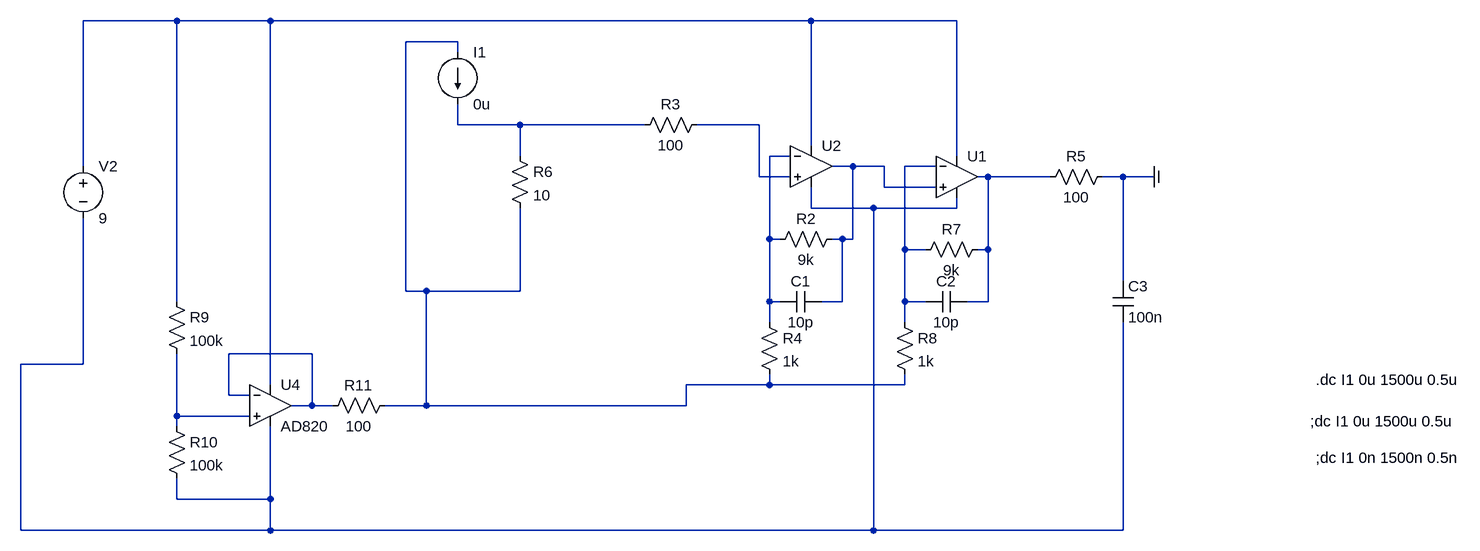
[diagram p0: schematic ucurrent.asc]
ucurrent.asc, the LTspice schematic file:
Version 4
SHEET 1 2176 968
WIRE -480 16 -624 16
WIRE -336 16 -480 16
WIRE 496 16 -336 16
WIRE 720 16 496 16
WIRE -48 48 -128 48
WIRE -48 64 -48 48
WIRE -48 176 -48 144
WIRE 48 176 -48 176
WIRE 240 176 48 176
WIRE 416 176 320 176
WIRE 496 208 496 16
WIRE 48 224 48 176
WIRE 464 224 432 224
WIRE 720 224 720 16
WIRE -624 240 -624 16
WIRE 560 240 528 240
WIRE 608 240 560 240
WIRE 688 240 640 240
WIRE 416 256 416 176
WIRE 464 256 416 256
WIRE 768 256 752 256
WIRE 864 256 768 256
WIRE 976 256 944 256
WIRE 1024 256 976 256
WIRE 608 272 608 240
WIRE 688 272 608 272
WIRE 496 304 496 272
WIRE 592 304 496 304
WIRE 720 304 720 288
WIRE 720 304 592 304
WIRE 432 352 432 224
WIRE 448 352 432 352
WIRE 544 352 528 352
WIRE 560 352 560 240
WIRE 560 352 544 352
WIRE 640 368 640 240
WIRE 672 368 640 368
WIRE 768 368 768 256
WIRE 768 368 752 368
WIRE 976 416 976 256
WIRE -128 432 -128 48
WIRE -96 432 -128 432
WIRE 48 432 48 304
WIRE 48 432 -96 432
WIRE -480 448 -480 16
WIRE 432 448 432 352
WIRE 448 448 432 448
WIRE 544 448 544 352
WIRE 544 448 512 448
WIRE 640 448 640 368
WIRE 672 448 640 448
WIRE 768 448 768 368
WIRE 768 448 736 448
WIRE 432 480 432 448
WIRE 640 480 640 448
WIRE -272 528 -400 528
WIRE -624 544 -624 320
WIRE -624 544 -720 544
WIRE -336 576 -336 16
WIRE 432 576 432 560
WIRE 432 576 304 576
WIRE 640 576 640 560
WIRE 640 576 432 576
WIRE -400 592 -400 528
WIRE -368 592 -400 592
WIRE -272 608 -272 528
WIRE -272 608 -304 608
WIRE -240 608 -272 608
WIRE -96 608 -96 432
WIRE -96 608 -160 608
WIRE 304 608 304 576
WIRE 304 608 -96 608
WIRE -480 624 -480 528
WIRE -368 624 -480 624
WIRE -480 640 -480 624
WIRE -480 752 -480 720
WIRE -336 752 -336 640
WIRE -336 752 -480 752
WIRE -720 800 -720 544
WIRE -336 800 -336 752
WIRE -336 800 -720 800
WIRE 592 800 592 304
WIRE 592 800 -336 800
WIRE 976 800 976 480
WIRE 976 800 592 800
FLAG 1024 256 COM
IOPIN 1024 256 Out
SYMBOL res 432 368 R270
WINDOW 0 32 56 VTop 2
WINDOW 3 0 56 VBottom 2
SYMATTR InstName R2
SYMATTR Value 9k
SYMBOL res 416 464 R0
SYMATTR InstName R4
SYMATTR Value 1k
SYMBOL res 848 272 R270
WINDOW 0 32 56 VTop 2
WINDOW 3 0 56 VBottom 2
SYMATTR InstName R5
SYMATTR Value 100
SYMBOL res 32 208 R0
SYMATTR InstName R6
SYMATTR Value 10
SYMBOL cap 512 432 R90
WINDOW 0 0 32 VBottom 2
WINDOW 3 32 32 VTop 2
SYMATTR InstName C1
SYMATTR Value 10p
SYMBOL res 224 192 R270
WINDOW 0 32 56 VTop 2
WINDOW 3 0 56 VBottom 2
SYMATTR InstName R3
SYMATTR Value 100
SYMBOL Opamps\\UniversalOpamp2 496 240 R0
SYMATTR InstName U2
SYMBOL current -48 64 R0
WINDOW 123 0 0 Left 0
WINDOW 39 0 0 Left 0
SYMATTR InstName I1
SYMATTR Value 0u
SYMBOL Opamps\\UniversalOpamp2 720 256 R0
SYMATTR InstName U1
SYMBOL res 656 384 R270
WINDOW 0 32 56 VTop 2
WINDOW 3 0 56 VBottom 2
SYMATTR InstName R7
SYMATTR Value 9k
SYMBOL cap 736 432 R90
WINDOW 0 0 32 VBottom 2
WINDOW 3 32 32 VTop 2
SYMATTR InstName C2
SYMATTR Value 10p
SYMBOL res 624 464 R0
SYMATTR InstName R8
SYMATTR Value 1k
SYMBOL res -496 432 R0
SYMATTR InstName R9
SYMATTR Value 100k
SYMBOL res -496 624 R0
SYMATTR InstName R10
SYMATTR Value 100k
SYMBOL res -144 592 R90
WINDOW 0 0 56 VBottom 2
WINDOW 3 32 56 VTop 2
SYMATTR InstName R11
SYMATTR Value 100
SYMBOL voltage -624 224 R0
WINDOW 123 24 124 Left 2
WINDOW 39 0 0 Left 0
SYMATTR InstName V2
SYMATTR Value 9
SYMBOL cap 960 416 R0
SYMATTR InstName C3
SYMATTR Value 100n
SYMBOL Opamps\\AD820 -336 544 R0
SYMATTR InstName U4
TEXT 1272 568 Left 2 !.dc I1 0u 1500u 0.5u
TEXT 1264 632 Left 2 !;dc I1 0u 1500u 0.5u
TEXT 1272 688 Left 2 !;dc I1 0n 1500n 0.5n

The netlist it stands for:
* ucurrent.asc
R2 N005 N006 9k
R4 N005 N002 1k
R5 N008 COM 100
R6 N003 N002 10
C1 N006 N005 10p
R3 N003 N004 100
XU2 N004 N005 N001 N009 N006 level.2 Avol=1Meg GBW=10Meg Slew=10Meg ilimit=25m rail=0 Vos=0 phimargin=45 en=0 enk=0 in=0 ink=0 Rin=500Meg  ; pins IN+ IN- V+ V- OUT
I1 N002 N003 0u
XU1 N006 N007 N001 N009 N008 level.2 Avol=1Meg GBW=10Meg Slew=10Meg ilimit=25m rail=0 Vos=0 phimargin=45 en=0 enk=0 in=0 ink=0 Rin=500Meg  ; pins IN+ IN- V+ V- OUT
R7 N007 N008 9k
C2 N008 N007 10p
R8 N007 N002 1k
R9 N001 N011 100k
R10 N011 N009 100k
R11 N002 N010 100
V2 N001 N009 9
C3 COM N009 100n
XU4 N011 N010 N001 N009 N010 AD820  ; pins In+ In- V+ V- OUT
.dc I1 0u 1500u 0.5u
;dc I1 0u 1500u 0.5u
;dc I1 0n 1500n 0.5n
.lib UniversalOpamps2.sub
.backanno
.end